# Altium schematic sheet SMU.SchDoc
size C; SheetNumber: 1; SheetTotal: 15
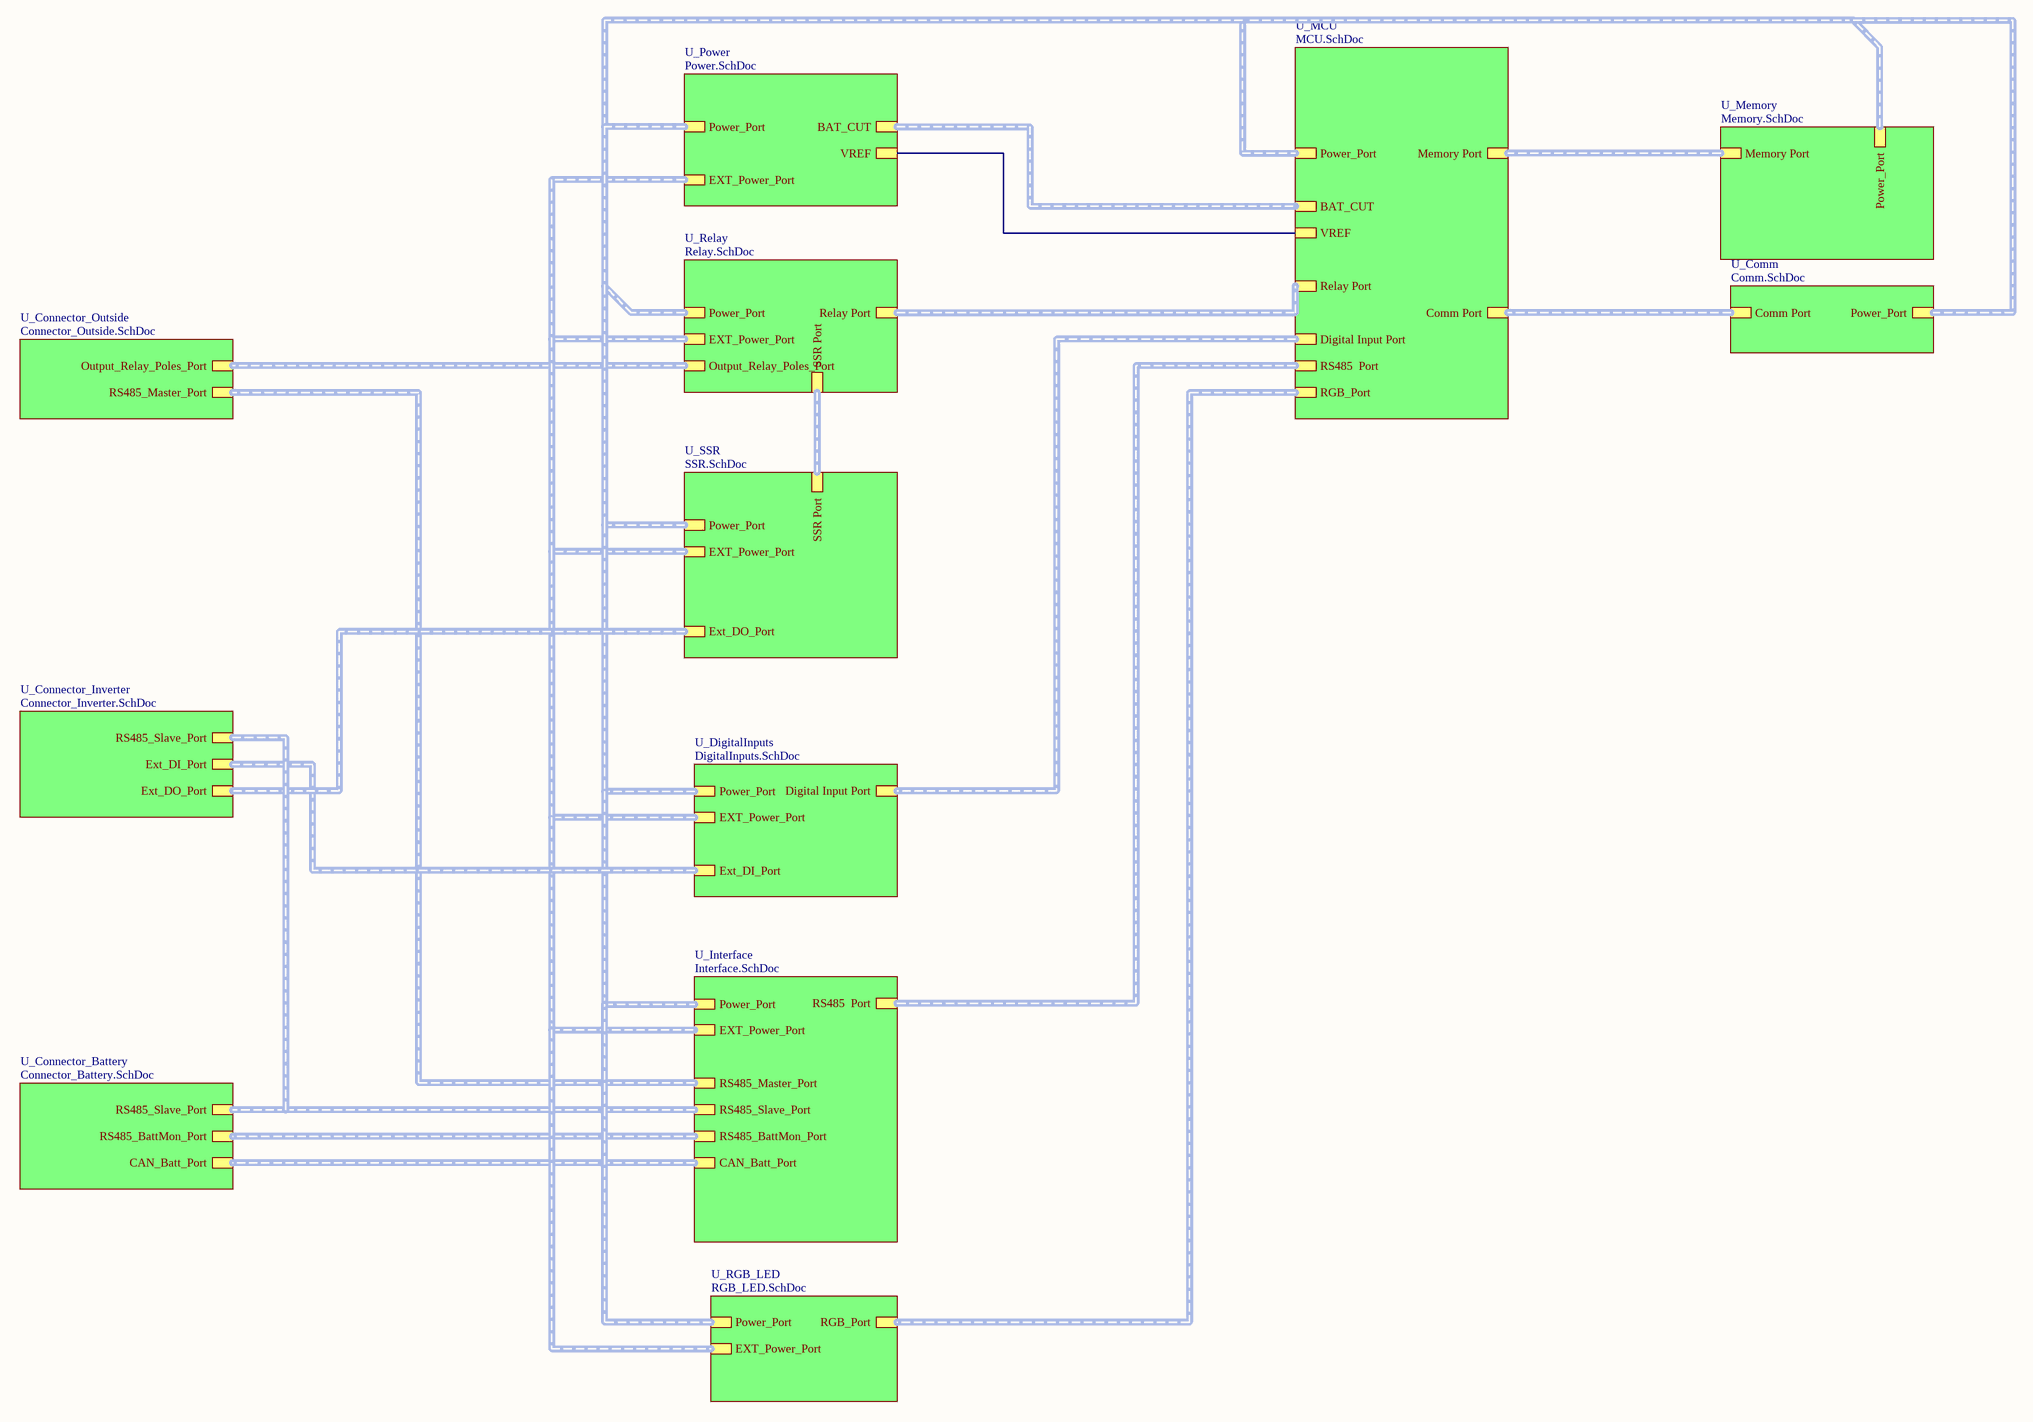
[diagram p0: SMU.SchDoc]

## Sub-sheets
U_Comm = Comm.SchDoc: Comm Port (harness Comm_Harness), Power_Port (harness Power_Harness)
U_Connector_Battery = Connector_Battery.SchDoc: RS485_Slave_Port (harness RS485_AB_Harness), RS485_BattMon_Port (harness RS485_AB_Harness), CAN_Batt_Port (harness CAN_HL_Harness)
U_Connector_Inverter = Connector_Inverter.SchDoc: RS485_Slave_Port (harness RS485_AB_Harness), Ext_DI_Port (harness Ext_DI_Harness), Ext_DO_Port (harness Ext_DO_Harness)
U_Connector_Outside = Connector_Outside.SchDoc: Output_Relay_Poles_Port (harness Output_Relay_Poles_Harness), RS485_Master_Port (harness RS485_AB_Harness)
U_DigitalInputs = DigitalInputs.SchDoc: Digital Input Port (harness Digital Input_Harness), EXT_Power_Port (harness EXT_Power_Harness), Power_Port (harness Power_Harness), Ext_DI_Port (harness Ext_DI_Harness)
U_Interface = Interface.SchDoc: RS485  Port (harness RS485_Harness), Power_Port (harness Power_Harness), EXT_Power_Port (harness EXT_Power_Harness), RS485_Master_Port (harness RS485_AB_Harness), RS485_Slave_Port (harness RS485_AB_Harness), RS485_BattMon_Port (harness RS485_AB_Harness), CAN_Batt_Port (harness CAN_HL_Harness)
U_MCU = MCU.SchDoc: Memory Port (harness Memory_Harness), Relay Port (harness Relay_Harness), Power_Port (harness Power_Harness), VREF, BAT_CUT (harness BAT_CUT_Harness), Comm Port (harness Comm_Harness), Digital Input Port (harness Digital Input_Harness), RS485  Port (harness RS485_Harness), RGB_Port (harness RGB_Harness)
U_Memory = Memory.SchDoc: Memory Port (harness Memory_Harness), Power_Port (harness Power_Harness)
U_Power = Power.SchDoc: Power_Port (harness Power_Harness), VREF, BAT_CUT (harness BAT_CUT_Harness), EXT_Power_Port (harness EXT_Power_Harness)
U_Relay = Relay.SchDoc: Relay Port (harness Relay_Harness), SSR Port (harness SSR_Harness), Power_Port (harness Power_Harness), EXT_Power_Port (harness EXT_Power_Harness), Output_Relay_Poles_Port (harness Output_Relay_Poles_Harness)
U_RGB_LED = RGB_LED.SchDoc: Power_Port (harness Power_Harness), EXT_Power_Port (harness EXT_Power_Harness), RGB_Port (harness RGB_Harness)
U_SSR = SSR.SchDoc: SSR Port (harness SSR_Harness), Power_Port (harness Power_Harness), EXT_Power_Port (harness EXT_Power_Harness), Ext_DO_Port (harness Ext_DO_Harness)

## Nets
(unnamed): sheet U_Power/VREF, sheet U_MCU/VREF

## Buses and harness runs
harness sheet U_Comm/Comm Port = sheet U_MCU/Comm Port
harness sheet U_Comm/Power_Port = sheet U_DigitalInputs/Power_Port = sheet U_Interface/Power_Port = sheet U_MCU/Power_Port = sheet U_Memory/Power_Port = sheet U_Power/Power_Port = sheet U_Relay/Power_Port = sheet U_RGB_LED/Power_Port = sheet U_SSR/Power_Port
harness sheet U_Connector_Battery/CAN_Batt_Port = sheet U_Interface/CAN_Batt_Port
harness sheet U_Connector_Battery/RS485_BattMon_Port = sheet U_Interface/RS485_BattMon_Port
harness sheet U_Connector_Battery/RS485_Slave_Port = sheet U_Connector_Inverter/RS485_Slave_Port = sheet U_Interface/RS485_Slave_Port
harness sheet U_Connector_Inverter/Ext_DI_Port = sheet U_DigitalInputs/Ext_DI_Port
harness sheet U_Connector_Inverter/Ext_DO_Port = sheet U_SSR/Ext_DO_Port
harness sheet U_Connector_Outside/Output_Relay_Poles_Port = sheet U_Relay/Output_Relay_Poles_Port
harness sheet U_Connector_Outside/RS485_Master_Port = sheet U_Interface/RS485_Master_Port
harness sheet U_DigitalInputs/Digital Input Port = sheet U_MCU/Digital Input Port
harness sheet U_DigitalInputs/EXT_Power_Port = sheet U_Interface/EXT_Power_Port = sheet U_Power/EXT_Power_Port = sheet U_Relay/EXT_Power_Port = sheet U_RGB_LED/EXT_Power_Port = sheet U_SSR/EXT_Power_Port
harness sheet U_Interface/RS485  Port = sheet U_MCU/RS485  Port
harness sheet U_MCU/BAT_CUT = sheet U_Power/BAT_CUT
harness sheet U_MCU/Memory Port = sheet U_Memory/Memory Port
harness sheet U_MCU/Relay Port = sheet U_Relay/Relay Port
harness sheet U_MCU/RGB_Port = sheet U_RGB_LED/RGB_Port
harness sheet U_Relay/SSR Port = sheet U_SSR/SSR Port